# EAGLE design pilote (EAGLE 7.6.0)
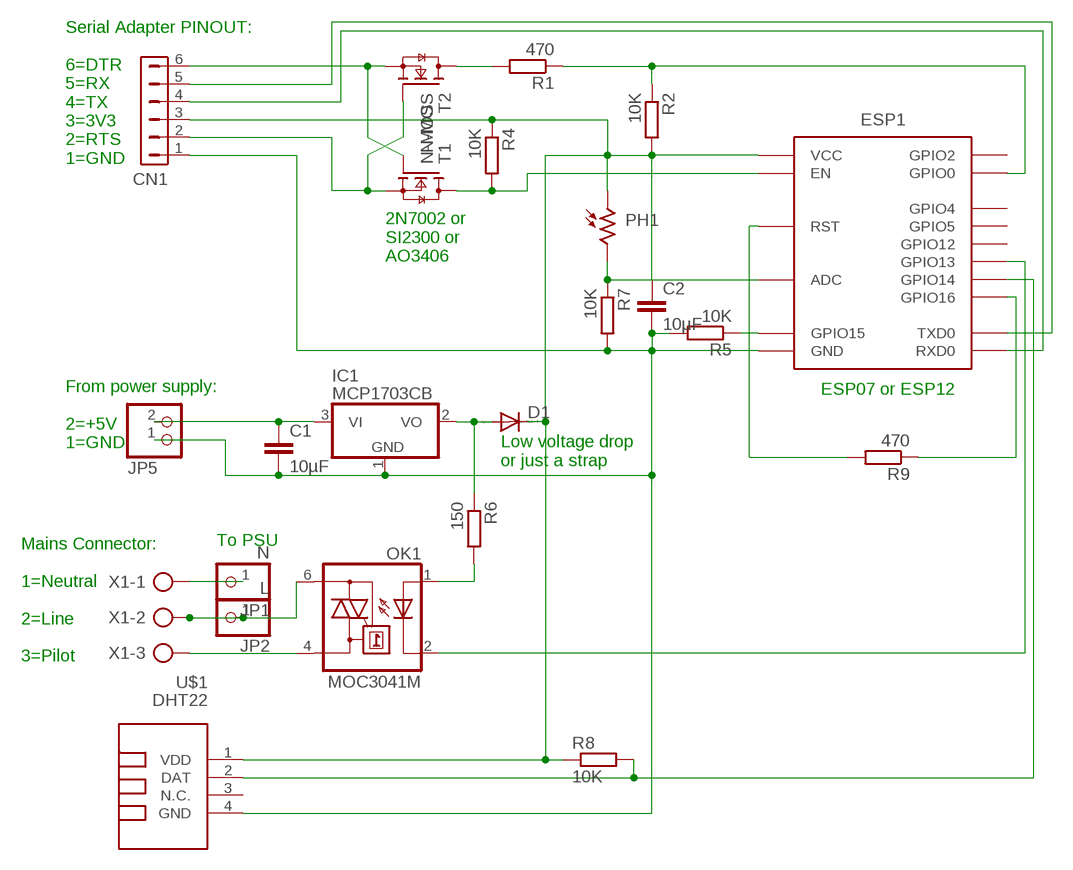
[diagram p0: schematic, sheet 1]

## Parts
C1  10µF  C-EUC1210  [C1210]
C2  10µF  C-EUC1210  [C1210]
CN1  HDR-1X6-SIP-100  [SIP-100-6V]
D1  DIODE-SOD123  [SOD123]
ESP1  ESP8266-07THT  [ESP-07]
IC1  MCP1703CB  [SOT23]
JP1  N  PINHD-1X1  [1X01]
JP2  L  PINHD-1X1  [1X01]
JP5  PINHD-1X2  [1X02]
OK1  MOC3041M  [DIL06]
PH1  A1050_09  [T0-46-A10XX]
R1  470  R-EU_M0805  [M0805]
R2  10K  R-EU_M0805  [M0805]
R4  10K  R-EU_M0805  [M0805]
R5  10K  R-EU_M0805  [M0805]
R6  150  R-EU_M0805  [M0805]
R7  10K  R-EU_M0805  [M0805]
R8  10K  R-EU_M0805  [M0805]
R9  470  R-EU_M0805  [M0805]
T1  N-MOS  2N7002E  [SOT23]
T2  N-MOS  2N7002E  [SOT23]
U$1  DHT22  TEMP-HUM-SENSOR-DHT22  [TEMP-HUM-SENSOR-DHT22]
X1  AK500/3  [AK500/3]

## Nets
N$1: ESP1.ADC PH1.2 R7.1
N$2: CN1.2 T1.1(G) T2.2(S)
N$3: CN1.6 T1.2(S) T2.1(G)
N$4: OK1.4(A1) X1.3
N$5: R1.2 T1.3(D)
N$6: ESP1.GPIO0 R1.1 R2.1
N$7: C2.1 CN1.3 D1.C ESP1.VCC PH1.1 R2.2 R4.1 R8.1 U$1.1(VDD)
N$8: JP1.1 X1.1
N$9: ESP1.EN R4.2 T2.3(D)
N$10: ESP1.RST R9.2
N$11: ESP1.GPIO15 R5.1
N$12: C1.1 IC1.3(VI) JP5.2
N$13: C1.2 C2.2 CN1.1 ESP1.GND IC1.1(GND) JP5.1 R5.2 R7.2 U$1.4(GND)
N$14: OK1.1(A) R6.2
N$15: JP2.1 OK1.6(A2) X1.2
N$16: CN1.4 ESP1.RX(RXD0)
N$17: ESP1.GPIO13 OK1.2(C)
N$18: CN1.5 ESP1.TX(TXD0)
N$19: ESP1.GPIO14 R8.2 U$1.2(DAT)
N$20: ESP1.GPIO16 R9.1
N$21: D1.A IC1.2(VO) R6.1
Unconnected: ESP1.GPIO2 ESP1.GPIO4 ESP1.GPIO5 ESP1.GPIO12 U$1.3(N.C.)

## Notes on the sheet
- Serial Adapter PINOUT:
  
  6=DTR
  5=RX
  4=TX
  3=3V3
  2=RTS
  1=GND
- 2N7002 or
  SI2300 or
  AO3406
- ESP07 or ESP12
- From power supply:
  
  2=+5V
  1=GND
- Low voltage drop
  or just a strap
- To PSU
- Mains Connector:
  
  1=Neutral
  
  2=Line
  
  3=Pilot

## Library data of the parts
C1 C2 = rcl:C-EU: CAPACITOR, European symbol
CN1 = con-hdrs40:HDR-1X6: HEADER CONNECTOR
D1 = diode:DIODE-: DIODE
ESP1 = esp8266-07:ESP8266-07
IC1 = linear:MCP1703: 250 mA, 16V, Low Quiescent Current LDO Regulator Source: http://ww1.microchip.com/downloads/en/DeviceDoc/22049b.pdf
JP1 JP2 = pinhead:PINHD-1X1: PIN HEADER
JP5 = pinhead:PINHD-1X2: PIN HEADER
OK1 = optocoupler-3-jcn:MOC30*: 6-Pin DIP Zero-Cross Optoisolators Triac Driver Output (250/400 Volt Peak) Source: http://www.fairchildsemi.com/ds/MO/MOC3043-M.pdf
PH1 = photo-elements:A10: Sensor Robust Light Sensing Applications Outdoor Light Sensing Application Source: http://optoelectronics.perkinelmer.com/content/Datasheets/DTS_PhotocellsA1050.pdf
R1 R2 R4-R9 = rcl:R-EU_: RESISTOR, European symbol
T1 T2 = nxp_60:2N7002: N-channel TrenchMOS FET N-channel enhancement mode Field-Effect Transistor (FET) in a plastic package using TrenchMOS technology. AAL Eindhoven MK
U$1 = diy-modules:TEMP-HUM-SENSOR-DHT22: DHT22 - digital humidity & temperature sensor Also known as: AM2302 AM2302 datasheet available here: http://akizukidenshi.com/download/ds/aosong/AM2302.pdf Click here to find device on ebay.com <http://www.ebay.com/sch/dht22+digital+sensor>
X1 = con-ptr500:AK500/3: CONNECTOR; OC_FARNELL: unknown; OC_NEWARK: unknown

## Board
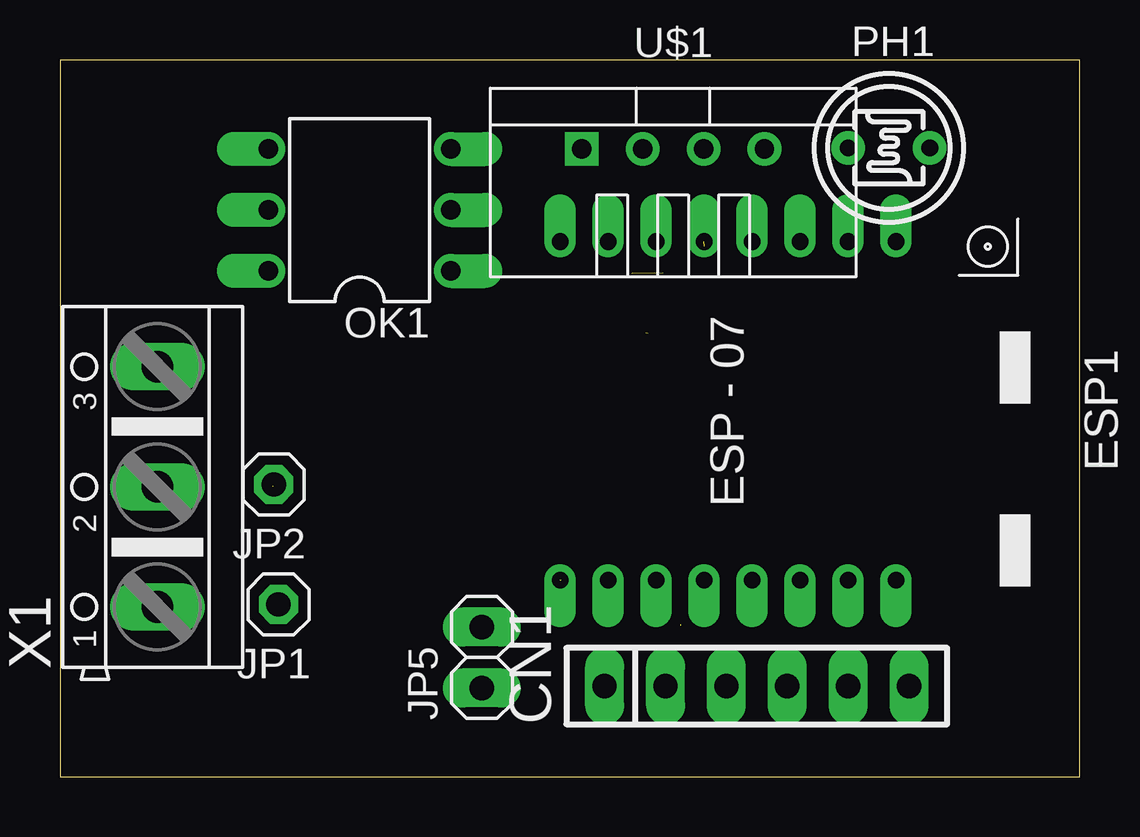
[diagram p1: board, top side]
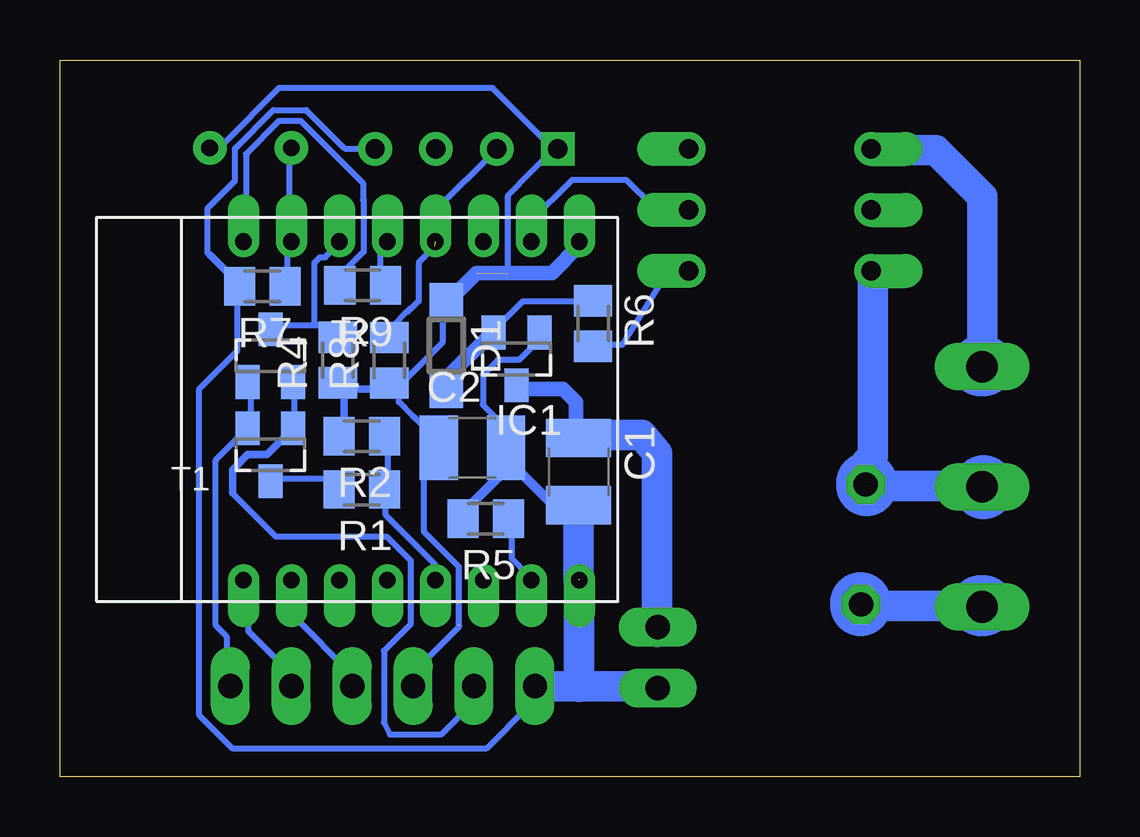
[diagram p2: board, bottom side, seen from below]

Size 42.5 x 29.88 mm. Coordinates in mm from the lower left corner, seen from the top.
Outline: 0,0 42.5,0 42.5,29.88 0,29.88 0,0
Copper layers (1*16): Top 0.035mm / dielectric 1.5mm / Bottom 0.035mm
Design rules "default *": minimum track width 10mil, minimum drill 24mil, track to track 7.5mil, track to pad 7.5mil, pad to pad 8mil, via to via 8mil, smd to smd 8mil, copper to edge 40mil, drill to drill 8mil, minimum pad ring 12mil, minimum via ring 8mil, stop-mask expansion 4mil, vias tented up to drill 0mil, thermal gap 10mil

### Footprints (pad centres in the part's own frame; a part is rotated, then mirrored left to right if it is on the bottom)
C1210 = smd 1.6 x 2.7: 1 -1.4,0; 2 1.4,0
SIP-100-6V = drill 1.016 long: 1 -6.35,0; 2 -3.81,0; 3 -1.27,0; 4 1.27,0; 5 3.81,0; 6 6.35,0
SOD123 = smd 1.4 x 1.4: A 1.9,0; C -1.9,0
ESP-07 = drill 0.7 offset: ADC -7.1,5.07; EN -7.1,3.07; GND 7.01,-6.93; GPIO0 7.01,-0.93; GPIO2 7.01,-2.93; GPIO4 7.01,1.07; GPIO5 7.01,3.07; GPIO12 -7.1,-2.93; GPIO13 -7.1,-4.93; GPIO14 -7.1,-0.93; GPIO15 7.01,-4.93; GPIO16 -7.1,1.07; RST -7.1,7.07; RX 7.01,5.07; TX 7.01,7.07; VCC -7.1,-6.93
SOT23 = smd 1 x 1.4: 1 -0.95,-1.1; 2 0.95,-1.1; 3 0,1.1
1X01 = drill 1.016 octagon: 1 0,0
1X02 = drill 1.016 long: 1 -1.27,0; 2 1.27,0
DIL06 = drill 0.813 offset: 1 -2.54,-3.81; 2 0,-3.81; 3 2.54,-3.81; 4 2.54,3.81; 5 0,3.81; 6 -2.54,3.81
T0-46-A10XX = drill 0.7 pad 1.4: 1 -1.7,0; 2 1.7,0
M0805 = smd 1.3 x 1.6: 1 -0.95,0; 2 0.95,0
TEMP-HUM-SENSOR-DHT22 = drill 0.8 square: 1 -3.81,0 | drill 0.8: 2 -1.27,0; 3 1.27,0; 4 3.81,0
AK500/3 = drill 1.321 long: 1 -5.004,0; 2 0,0; 3 5.004,0

### Placement (x,y rotation side)
C1  20.88,12.71 270 bottom
C2  25.3,13.71 0 bottom
CN1  29.05,3.77 0 top
D1  26.39,17.96 270 bottom
ESP1  27.78,15.2 270 top
IC1  23.47,17.41 180 bottom
JP1  9.11,7.17 180 top
JP2  8.91,12.18 180 top
JP5  17.59,4.96 90 top
OK1  12.49,23.62 90 top
PH1  34.55,26.21 180 top
R1  29.91,11.97 180 bottom
R2  29.91,14.19 180 bottom
R4  30.93,17.36 90 bottom
R5  24.75,10.76 180 bottom
R6  20.28,18.89 270 bottom
R7  34.06,20.43 180 bottom
R8  28.77,17.36 90 bottom
R9  29.88,20.47 180 bottom
T1  33.73,13.42 180 bottom
T2  33.73,17.55 0 bottom
U$1  25.56,26.16 0 top
X1  4.06,12.08 90 top

### Tracks (layer width: path | path; a pad name or v marks a point on that pad's centre or on a via)
N$1
  Bottom 0.254: 32.81,22.34 ESP1.ADC | R7.1 33.04,20.51 33.04,22.11 ESP1.ADC | ESP1.ADC | PH1.2 32.92,26.18 32.92,22.53 ESP1.ADC
N$2
  Bottom 0.254: T2.2 32.71,16.29 32.71,14.69 T1.1 | 35.31,11.83 35.32,11.82 33.49,9.99 28.87,9.99 27.88,9 27.88,6.38 29,5.25 29,2.25 28.75,1.75 26.62,1.75 25.24,3.13 CN1.2
  Bottom 0.305: T1.1 33.88,13.42 34.68,13.42 35.31,12.79 35.31,11.83
N$3
  Bottom 0.254: T2.1 34.54,16.29 34.54,14.69 T1.2 34.87,14.34 36.01,13.19 36.01,6.29 35.55,5.83 35.55,3.82 CN1.6
N$4
  Bottom 1.27: OK1.4 8.64,26.12 6,26.12 4.06,24.18 X1.3
N$5
  Bottom 0.254: T1.3 33.62,12.4 30.88,12.4 30.88,12.18 R1.2
N$6
  Bottom 0.254: 28.59,12.4 28.82,12.4 | 28.82,12.4 28.82,14 R2.1 | 28.82,12.4 R1.1 28.92,11.82 28.92,10.91 26.87,8.85 26.87,8.39 ESP1.GPIO0
N$7  (2 unrouted)
  Bottom 0.254: 26.08,12.86 C2.1 26.87,13.19 26.87,13.62 | 27.68,14.92 27.78,15.02 | 27.78,15.02 28.37,15.6 28.37,16.06 28.59,16.29 R8.1 | 28.82,16.16 28.82,16.29 R8.1 | R4.1 30.88,16.29 30.65,16.29 30.65,16.16 | 30.65,14.69 30.65,14.23 R2.2 | 28.14,16.52 28.59,16.52 R8.1 | 26.31,20.18 26.31,19.72 D1.C | 28.14,16.52 26.54,18.12 26.54,19.49 26.47,19.66 D1.C | 28.14,16.52 R8.1 | 26.41,20.05 D1.C | 23.84,20.97 23.84,24.19 21.84,26.25 U$1.1 21.95,26.18 24.46,28.7 33.38,28.7 35.66,26.41 36.12,26.41 PH1.1 | 26.87,13.62 26.87,14.11 27.78,15.02 | 25.88,6.33 25.88,8.75 27.33,10.21 27.33,13.16 26.87,13.62 | 25.88,6.31 25.88,6.25 27.62,4.5 27.62,3.92 CN1.3
  Bottom 0.305: 30.65,14.69 30.65,16.16 28.82,16.16
  Bottom 0.61: ESP1.VCC 20.85,22.15 22,21 25.13,21 26.47,19.66
N$8
  Bottom 0.254: X1.1 4.01,7.02 4.01,7.12
  Bottom 1.27: JP1.1 9.05,7.12 4.12,7.12 4.01,7.12 4,7.12 3.38,7.12
  Bottom 2.54: 4,7.12 4.12,7.12
N$9
  Bottom 0.254: 30.65,18.8 30.88,18.8 | 30.88,18.8 31.89,18.8 | 31.89,18.8 33.62,18.8 T2.3 | 30.88,18.8 30.88,18.35 R4.2 | 31.89,18.8 31.89,21.42 31.67,21.65 31.44,21.65 30.98,22.11 ESP1.EN
N$10
  Bottom 0.254: 29.84,24.06 29.84,24 | 29.84,24 29.84,21.88 30.75,20.97 30.75,20.51 R9.2 30.88,20.63 | ESP1.RST 34.75,22.53 34.75,25.96 33.38,27.33 32.45,27.33 29.88,24.75 29.88,24.04 29.84,24
N$11
  Bottom 0.254: R5.1 23.66,10.91 23.66,9.08 22.98,8.39 ESP1.GPIO15
N$12
  Bottom 0.254: 23.44,16.16 IC1.3 | C1.1 20.69,14.11 20.69,14.25
  Bottom 0.61: 23.44,16.16 21.54,16.16 21,15.62 21,14.25
  Bottom 1.27: JP5.2 17.62,6.03 17.62,13.5 18.25,14.25 20.69,14.25 21,14.25
N$13  (1 unrouted)
  Bottom 0.254: 35.12,20.62 35.09,20.51 R7.2 35.09,19.82 35.09,17.77 36.7,16.16 36.7,2.55 35.32,1.18 24.7,1.18 22.98,2.91 22.98,3.36 CN1.1 22.75,3.36 | 25.49,11.14 R5.2 | IC1.1 22.29,18.45 23.37,17.38 24.25,17.38 24.88,16.75 24.88,15.5 24,14.62 24,14.11 | 24,14.11 24,14 | 24,14.11 23.89,14.11 23.89,13.88 C2.2 23.66,12.96 | 20.92,8.16 ESP1.GND 20.92,7.71 20.88,7.71 | 23.66,12.96 23.8,12.91 | 23.66,12.96 23.63,13 | U$1.4 29.49,26.18 30.63,26.18 32.23,27.79 33.6,27.79 35.2,26.18 35.2,24.84 36.35,23.69 36.35,21.84 36.25,21.75
  Bottom 0.305: 36.25,21.75 35.12,20.62 35.12,19.79
  Bottom 0.406: 25.49,11.14 25.49,11.22 23.8,12.91 | C1.2 21.94,11.31 23.63,13 23.88,13.25
  Bottom 1.27: 20.88,8.12 20.88,7.71 20.88,3.75 20.89,3.77 | 20.89,3.77 CN1.1 | JP5.1 17.66,3.77 20.89,3.77 | 20.88,8.21 C1.2
N$14
  Bottom 0.254: R6.2 20.24,17.99 19.07,17.99 17.23,20.97 OK1.1
N$15  (1 unrouted)
  Bottom 0.254: 4.23,12.28 X1.2 4.01,12.05 4.01,12.12 | 8.58,20.97 OK1.6 | 8.81,12.74 JP2.1
  Bottom 1.27: JP2.1 8.87,12.12 4.01,12.12 4,12.12 3.75,12.12 | 8.58,20.97 8.62,20.92 8.62,13.38 8.88,13.12 8.88,12.25 | 8.88,12.12 8.88,12
  Bottom 2.54: 8.88,12.12 8.88,12.25 | 4,12.12 4,12
N$16
  Bottom 0.254: ESP1.RX 32.81,8.16 32.68,6.61 30.4,4.32 CN1.4
N$17
  Bottom 0.254: ESP1.GPIO13 22.75,22.34 22.88,23.15 21.15,24.87 18.89,24.87 17.73,23.71 OK1.2
N$18
  Bottom 0.254: ESP1.TX 34.64,8.16 34.64,6.05 33.04,4.45 CN1.5
N$19  (1 unrouted)
  Bottom 0.254: 27.91,19.49 28.02,19.38 | 28.02,19.38 28.59,18.8 28.59,18.35 R8.2 | 28.02,19.38 28.01,19.37 27.55,19.82 27.55,21.42 26.87,22.11 26.87,23.59 U$1.2
N$20
  Bottom 0.254: 29.05,21.09 29.05,20.63 R9.1 29.15,20.97 29.15,21.88 28.92,22.11 ESP1.GPIO16
N$21  (1 unrouted)
  Bottom 0.254: R6.1 20.46,19.82 23.21,19.82 24.35,18.68 IC1.2 | 26.39,16.54 D1.A
  Bottom 0.61: 26.39,16.54 26.39,16.61 24.5,18.5
N$22
  Bottom 2.54: 9.12,7.12 9.12,7.25
N$23
  Bottom 2.54: 4,17.12 4.12,17.12